# EAGLE design RCA (EAGLE 6.5.0)
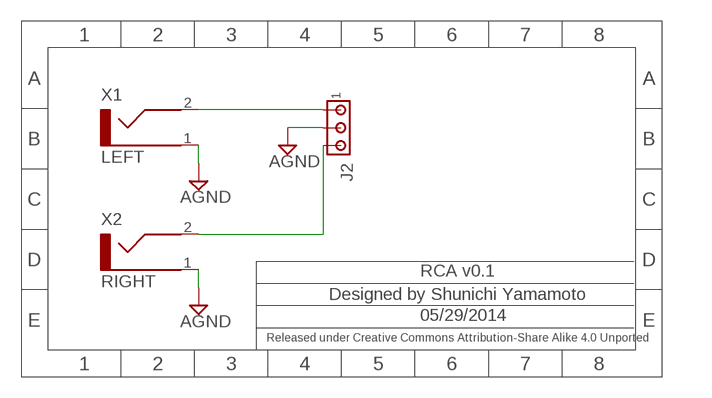
[diagram p0: schematic, sheet 1]

## Parts
J2  MTA03-100  [10X03MTA]
X1  LEFT  RCA_JACK_CUI  [RCA_JACK_CUI]
X2  RIGHT  RCA_JACK_CUI  [RCA_JACK_CUI]

## Nets
AGND: J2.2 X1.1 X2.1
N$1: J2.1 X1.2
N$2: J2.3 X2.2

## Notes on the sheet
- RCA v0.1
- Designed by Shunichi Yamamoto
- 05/29/2014
- Released under Creative Commons Attribution-Share Alike 4.0 Unported

## Library data of the parts
J2 = con-amp:MTA03-100: AMP connector
X1 X2 = tkrworks:RCA_JACK_CUI

## Board
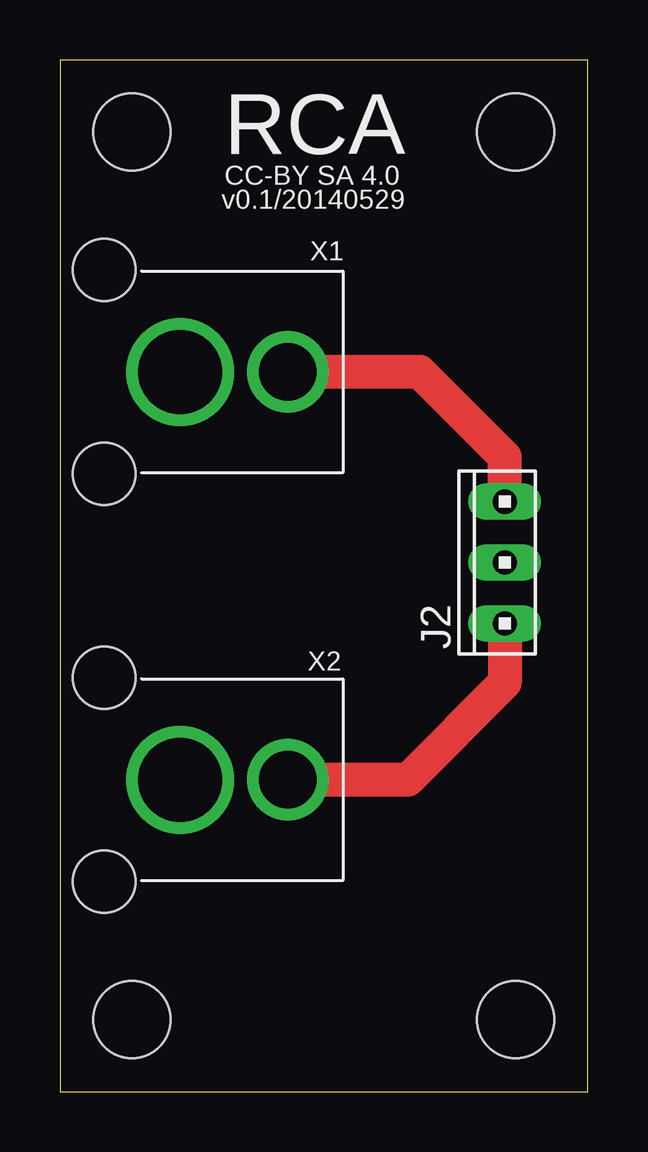
[diagram p1: board, top side]
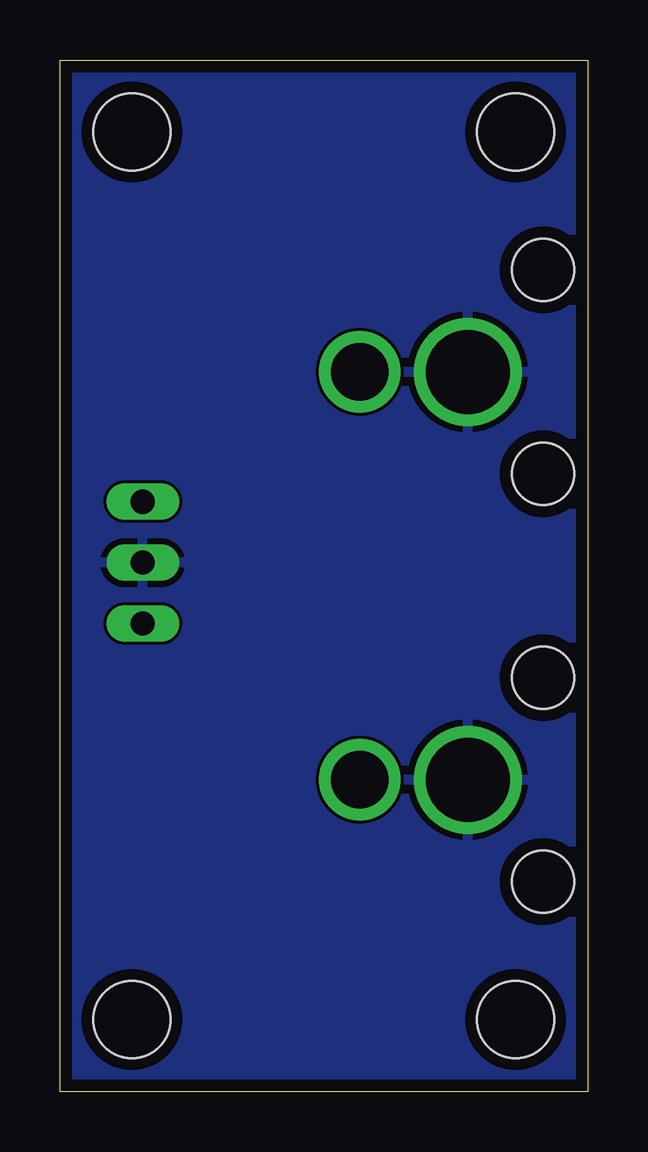
[diagram p2: board, bottom side, seen from below]

Size 22 x 43 mm. Coordinates in mm from the lower left corner, seen from the top.
Outline: 0,0 22,0 22,43 0,43 0,0
Copper layers (1*16): Top 0.035mm / dielectric 1.53mm / Bottom 0.035mm
Design rules "pban_5mil-l2": minimum track width 5mil, minimum drill 0.3mm, track to track 5mil, track to pad 0.229mm, pad to pad 5mil, via to via 5mil, smd to smd 5mil, copper to edge 0.5mm, drill to drill 0.5mm, minimum pad ring 0.15mm, minimum via ring 0.15mm, stop-mask expansion 4mil, vias tented up to drill 0.35mm, thermal gap 10mil
Holes 3.2 mm at 19,40 3,40 3,3 19,3

### Footprints (pad centres in the part's own frame; a part is rotated, then mirrored left to right if it is on the bottom)
10X03MTA = drill 1.016 long: 1 2.54,0; 2 0,0; 3 -2.54,0
RCA_JACK_CUI = drill 3.5: 1 -4,0 | drill 2.4: 2 -8.5,0 | hole 2.6: -0.85,-4.25; -0.85,4.25

### Placement (x,y rotation side)
J2  18.55,22.05 90 top
X1  1,30 180 top
X2  1,13 180 top

### Tracks (layer width: path | path; a pad name or v marks a point on that pad's centre or on a via)
AGND
  pour Bottom: 0,43 0,0 22,0 22,43
N$1
  Top 1.422: J2.1 18.55,26.45 15,30 X1.2
N$2
  Top 1.422: J2.3 18.55,17.05 14.5,13 X2.2

### Text on the board
tNames: RCA | CC-BY SA 4.0 | v0.1/20140529